# Altium project Proj_USB_GPIB.PrjPcb
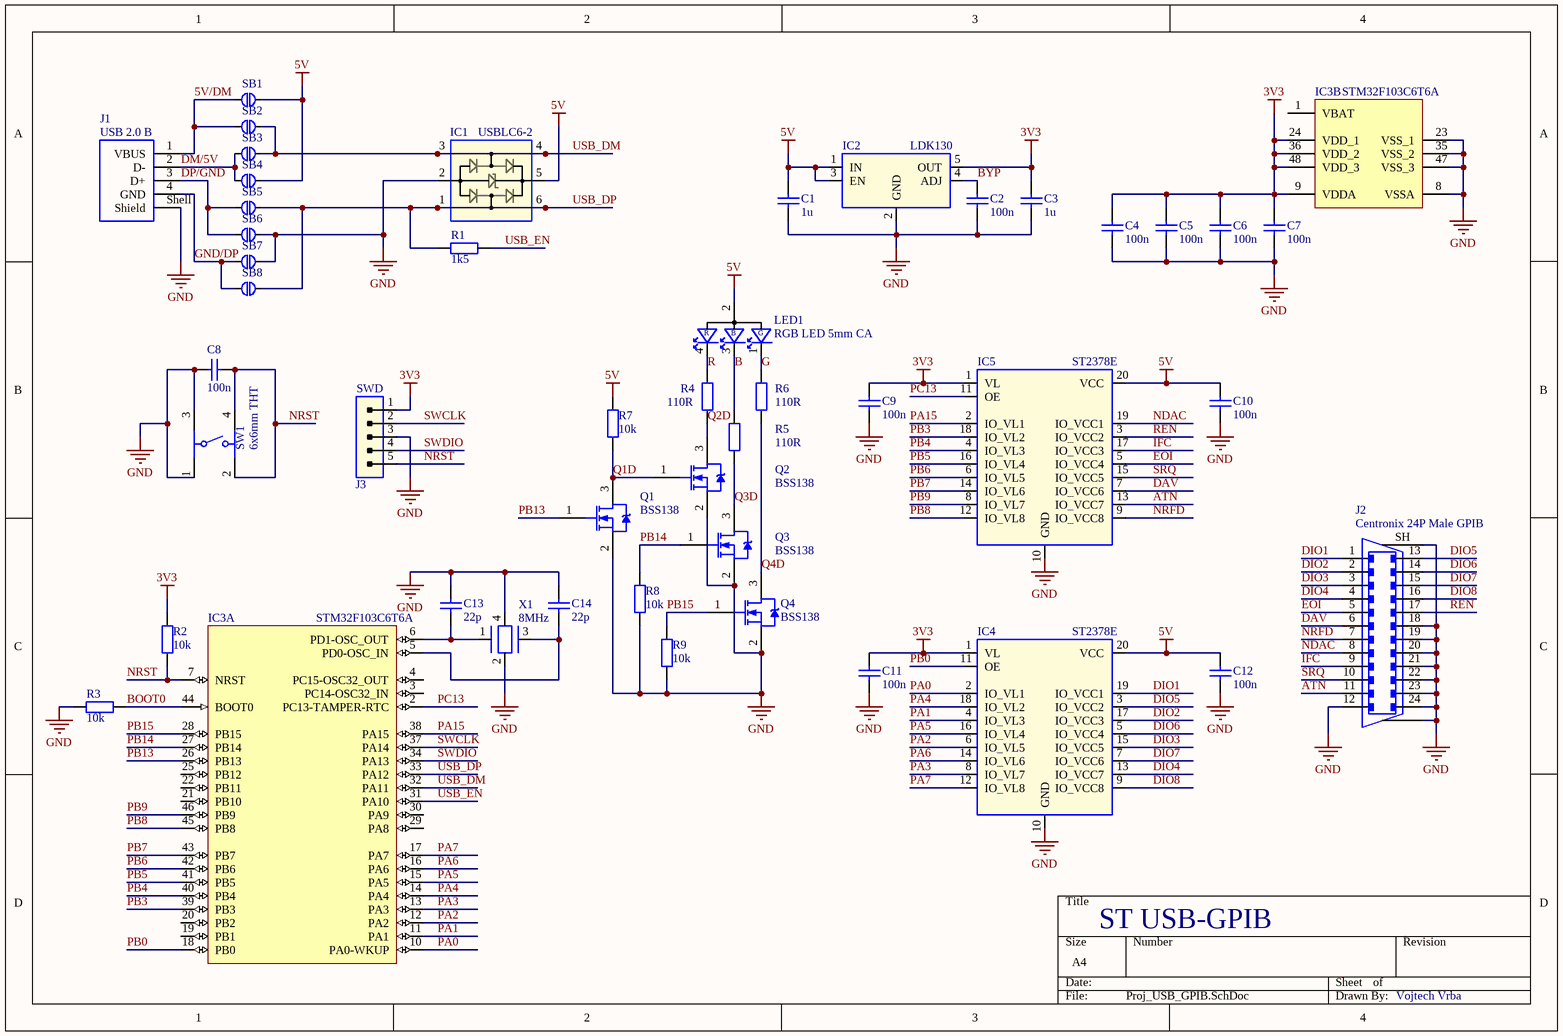
[diagram p0: Proj_USB_GPIB.SchDoc]
1 sheet, 46 parts. Net scope: global (net labels, ports and power ports of the same name join across sheets).
Board file: Proj_USB_GPIB.PcbDoc

## Sheet Proj_USB_GPIB.SchDoc
size A4

### Parts
C1  value 1u  [0603]  (hidden comment: Cap)
C2  value 100n  [0603]  (hidden comment: Cap)
C3  value 1u  [0603]  (hidden comment: Cap)
C4  value 100n  [0603]  (hidden comment: Cap)
C5  value 100n  [0603]  (hidden comment: Cap)
C6  value 100n  [0603]  (hidden comment: Cap)
C7  value 100n  [0603]  (hidden comment: Cap)
C8  value 100n  [0603]  (hidden comment: Cap)
C9  value 100n  [0603]  (hidden comment: Cap)
C10  value 100n  [0603]  (hidden comment: Cap)
C11  value 100n  [0603]  (hidden comment: Cap)
C12  value 100n  [0603]  (hidden comment: Cap)
C13  value 22p  [0603]  (hidden comment: Cap)
C14  value 22p  [0603]  (hidden comment: Cap)
IC1  USBLC6-2  [SOT23-6]
IC2  LDK130  [SOT23-5]
IC3  STM32F103C6T6A  [STM-LQFP48_L]  (parts A,B of 2)
IC4  ST2378E  [TSSOP20]
IC5  ST2378E  [TSSOP20]
J1  USB 2.0 B  [61400416121]
J2  Centronix 24P Male GPIB  [Norcomp-112-024-213R001]
J3  SWD  [PIN_HEADER_5P]
LED1  RGB LED 5mm CA  [RGB_LED_5mm]
Q1  BSS138  [SOT23-3]
Q2  BSS138  [SOT23-3]
Q3  BSS138  [SOT23-3]
Q4  BSS138  [SOT23-3]
R1  value 1k5  [0603]  (hidden comment: Res)
R2  value 10k  [0603]  (hidden comment: Res)
R3  value 10k  [0603]  (hidden comment: Res)
R4  value 110R  [0603]  (hidden comment: Res)
R5  value 110R  [0603]  (hidden comment: Res)
R6  value 110R  [0603]  (hidden comment: Res)
R7  value 10k  [0603]  (hidden comment: Res)
R8  value 10k  [0603]  (hidden comment: Res)
R9  value 10k  [0603]  (hidden comment: Res)
SB1  SHORT_CON2  [0402]  (value not drawn)
SB2  SHORT_CON2  [0402]  (value not drawn)
SB3  SHORT_CON2  [0402]  (value not drawn)
SB4  SHORT_CON2  [0402]  (value not drawn)
SB5  SHORT_CON2  [0402]  (value not drawn)
SB6  SHORT_CON2  [0402]  (value not drawn)
SB7  SHORT_CON2  [0402]  (value not drawn)
SB8  SHORT_CON2  [0402]  (value not drawn)
SW1  6x6mm THT  [4301x60957x6]
X1  8MHz  [CRYSTAL_5x3.2mm]

### Nets
3V3: C3.1 C4.1 C5.1 C6.1 C7.1 C9.1 C11.1 IC2.5(OUT) IC3.9(VDDA) IC3.24(VDD_1) IC3.36(VDD_2) IC3.48(VDD_3) IC4.1(VL) IC5.1(VL) J3.1 R2.2
5V: C1.1 C10.1 C12.1 IC1.5(VP) IC2.1(IN) IC2.3(EN) IC4.20(VCC) IC5.20(VCC) LED1.2(A) R7.2 SB1.2 SB4.2
GND: C1.2 C2.2 C3.2 C4.2 C5.2 C6.2 C7.2 C8.1 C9.2 C10.2 C11.2 C12.2 C13.2 C14.2 IC1.2(VN) IC2.2(GND) IC3.8(VSSA) IC3.23(VSS_1) IC3.35(VSS_2) IC3.47(VSS_3) IC4.10(GND) IC5.10(GND) J1.Shell(Shield) J2.12 J2.18 J2.19 J2.20 J2.21 J2.22 J2.23 J2.24 J2.SH J3.3 Q1.2(S) Q2.2(S) Q3.2(S) Q4.2(S) R3.2 R8.1 R9.1 SB6.2 SB7.2 SW1.1 SW1.3 X1.2 X1.4
5V/DM: J1.1(VBUS) SB1.1 SB2.1
ATN: IC5.13(IO_VCC7) J2.11
B: LED1.3(B) R5.1
BOOT0: IC3.44(BOOT0) R3.1
BYP: C2.1 IC2.4(ADJ)
DAV: IC5.7(IO_VCC6) J2.6
DIO1: IC4.19(IO_VCC1) J2.1
DIO2: IC4.17(IO_VCC3) J2.2
DIO3: IC4.15(IO_VCC5) J2.3
DIO4: IC4.13(IO_VCC7) J2.4
DIO5: IC4.3(IO_VCC2) J2.13
DIO6: IC4.5(IO_VCC4) J2.14
DIO7: IC4.7(IO_VCC6) J2.15
DIO8: IC4.9(IO_VCC8) J2.16
DM/5V: J1.2(D-) SB3.1 SB4.1
DP/GND: J1.3(D+) SB5.1 SB6.1
EOI: IC5.5(IO_VCC4) J2.5
G: LED1.1(G) R6.1
GND/DP: J1.4(GND) SB7.1 SB8.1
IFC: IC5.17(IO_VCC3) J2.9
NDAC: IC5.19(IO_VCC1) J2.8
NRFD: IC5.9(IO_VCC8) J2.7
NRST: C8.2 IC3.7(NRST) J3.5 R2.1 SW1.2 SW1.4
PA0: IC3.10(PA0-WKUP) IC4.2(IO_VL1)
PA1: IC3.11(PA1) IC4.4(IO_VL3)
PA2: IC3.12(PA2) IC4.6(IO_VL5)
PA3: IC3.13(PA3) IC4.8(IO_VL7)
PA4: IC3.14(PA4) IC4.18(IO_VL2)
PA5: IC3.15(PA5) IC4.16(IO_VL4)
PA6: IC3.16(PA6) IC4.14(IO_VL6)
PA7: IC3.17(PA7) IC4.12(IO_VL8)
PA15: IC3.38(PA15) IC5.2(IO_VL1)
PB0: IC3.18(PB0) IC4.11(OE)
PB3: IC3.39(PB3) IC5.18(IO_VL2)
PB4: IC3.40(PB4) IC5.4(IO_VL3)
PB5: IC3.41(PB5) IC5.16(IO_VL4)
PB6: IC3.42(PB6) IC5.6(IO_VL5)
PB7: IC3.43(PB7) IC5.14(IO_VL6)
PB8: IC3.45(PB8) IC5.12(IO_VL8)
PB9: IC3.46(PB9) IC5.8(IO_VL7)
PB13: IC3.26(PB13) Q1.1(G)
PB14: IC3.27(PB14) Q3.1(G) R8.2
PB15: IC3.28(PB15) Q4.1(G) R9.2
PC13: IC3.2(PC13-TAMPER-RTC) IC5.11(OE)
Q1D: Q1.3(D) Q2.1(G) R7.1
Q2D: Q2.3(D) R4.2
Q3D: Q3.3(D) R5.2
Q4D: Q4.3(D) R6.2
R: LED1.4(R) R4.1
REN: IC5.3(IO_VCC2) J2.17
SRQ: IC5.15(IO_VCC5) J2.10
SWCLK: IC3.37(PA14) J3.2
SWDIO: IC3.34(PA13) J3.4
USB_DM: IC1.3(IO) IC1.4(IO) IC3.32(PA11) SB2.2 SB3.2
USB_DP: IC1.1(IO) IC1.6(IO) IC3.33(PA12) R1.1 SB5.2 SB8.2
USB_EN: IC3.31(PA10) R1.2
NetC13_1: C13.1 IC3.6(PD1-OSC_OUT) X1.1
NetC14_1: C14.1 IC3.5(PD0-OSC_IN) X1.3

Not connected (* = marked no-connect by the designer): IC3 1(VBAT) 3(PC14-OSC32_IN) 4(PC15-OSC32_OUT) 19(PB1) 20(PB2) 21(PB10) 22(PB11) 25(PB12) 29(PA8) 30(PA9)

### Notes on the sheet
- ST USB-GPIB
- Vojtech Vrba

### Library data of the parts
C1-C14 = Cap: Capacitor; Published: 8-Jun-2000; LatestRevisionDate: 17-Jul-2002; LatestRevisionNote: Re-released for DXP Platform.; PackageReference: RAD-0.3; Publisher: Altium Limited
IC1 = USBLC6-2: Very low capacitance ESD protection diode array
IC2 = LDK130: 300 mA low quiescent current very low noise LDO
IC3 = STM32F103C6T6A: ARM Cortex-M3 32-bit MCU, 32 KB Flash, 10 KB Internal RAM, 37 I/Os, 48-pin LQFP, -40 to 85 degC, Tray; A/D Converter: 2x12-bit (10 Channel); FLASH Size (Prog) (kB): 32; I/Os (High Current): 37; Internal RAM Size (kB): 10; Operating Frequency(F) (Processor speed) (MHz): 72; Supply Voltage(Vcc) min (V): 2; DatasheetVersion: Rev. 6; PackageVersion: Rev. 6, 06/2013; PackageReference: LQFP48; PackageDescription: 48-Pin Low Profile Quad Flat Package, 7 x 7 mm Body, 0.5 mm Pitch; Supplier 1: Digi-Key; Supplier Part Number 1: 497-11515-ND; Supplier 2: Farnell; Supplier Part Number 2: 1972391; Supplier 3: Newark; Supplier Part Number 3: 72T2643; Supplier 4: Newark; Supplier Part Number 4: 57P1219; Supplier 5: Mouser; Supplier Part Number 5: 511-STM32F103C6T6A; Core: ARM Cortex-M3; Packing: Tray; Mounting Technology: Surface Mount; PartNumber: STM32F103C6T6A; ComponentLink1Description: Manufacturer URL; ComponentLink1URL: http://www.st.com/web/en/home.html; ComponentLink2Description: Datasheet; ComponentLink2URL: http://www.st.com/st-web-ui/static/active/en/resource/technical/document/datasheet/CD00210843.pdf; ComponentLink3Description: Package Specification; ComponentLink3URL: http://www.st.com/st-web-ui/static/active/en/resource/technical/document/datasheet/DM00058181.pdf
IC4 IC5 = ST2378E: 8-bit dual supply 1.71 V to 5.5 V level translator  with I/O VCC ±15 kV ESD protection
J1 = 61400416121: USB 2.0 Type B, Receptacle, Horizontal, THT; Manufacturer: Wurth Elektronik; Rated Current: 1.5A; Pin Number: 4; Interface Type: Type B; Working Voltage: 30VAC; ComponentLink1Description: Manufacturer; ComponentLink1URL: http://www.we-online.de; ComponentLink2Description: Datasheet; ComponentLink2URL: https://katalog.we-online.com/em/datasheet/61400416121.pdf; Published Date: August 2020; Manufacturer Part Number: 61400416121; Gender: Receptacle; Type: Horizontal; Packaging: Tray; Operating Temperature: -40 to +105degC; Mounting Technology: THT; Application: USB 2.0
J2 = Centronix 24P Male GPIB: Centronix 24P Male THT GPIB Connector, Farnell 2421095
J3 = Pin Header 5P
LED1 = RGB LED 5mm CA: 5mm RGB LED Common Anode, eg. OSTHMA5B61A
Q1-Q4 = BSS138: MOSFET SOT-23 N-CH LOGIC LEVEL; Published: 17-Sep-2003; DatasheetVersion: PD-9.486C; PackageReference: TO-254AA; Publisher: Altium Limited; PackageDescription: TO, Thru-Hole, Vertical, Heatsink Mounted; 3 In-Line Leads; Pitch 3.81 mm; Code_JEDEC: TO-254-AA; ComponentLink1Description: Manufacturer Link; ComponentLink1URL: http://www.irf.com/; ComponentLink2Description: Datasheet; ComponentLink2URL: http://www.irf.com/product-info/datasheets/data/IRFM460.pdf
R1-R9 = Res: Resistor; Published: 8-Jun-2000; LatestRevisionDate: 17-Jul-2002; LatestRevisionNote: Re-released for DXP Platform.; PackageReference: AXIAL-0.4; Publisher: Altium Limited
SW1 = 430186095716: WS-TATV THT Tact Switch 6x6mm, height 9.5mm, 160gf; Rated Voltage: 12VDC; Rated Current: 50mA; Washable: No; ComponentLink1Description: Manufacturer; ComponentLink1URL: http://www.we-online.de; ComponentLink2Description: Datasheet; ComponentLink2URL: https://katalog.we-online.com/em/datasheet/430186095716.pdf; Operating Temperature: -40 to +85degC; Part Number: 430186095716; Published Date: September 2019; Contact Material: Stainless Steel; Height: 9.5mm; Mounting Technology: THT; Contact Plating: Silver; Operation Force: 160gf; Packaging: Bulk; Terminal Material: Copper Alloy; Publisher: Wurth Elektronik; Terminal Plating: Silver
X1 = Crystal